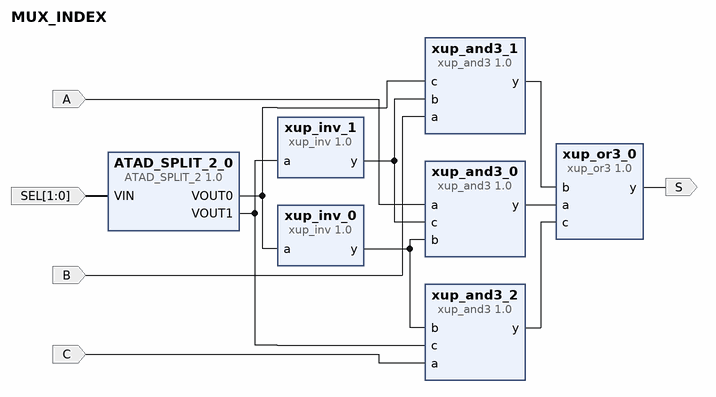
[diagram p0: block diagram of the top level]
# Vivado block design MUX_INDEX, xc7a100tcsg324-1, Vivado 2020.1
create_bd_design MUX_INDEX

create_bd_port -dir I A
create_bd_port -dir I B
create_bd_port -dir I C
create_bd_port -dir I -from 1 -to 0 SEL
create_bd_port -dir O S

create_bd_cell -type ip -vlnv xilinx.com:user:ATAD_SPLIT_2:1.0 ATAD_SPLIT_2_0
create_bd_cell -type ip -vlnv xilinx.com:xup:xup_inv:1.0 xup_inv_0
create_bd_cell -type ip -vlnv xilinx.com:xup:xup_inv:1.0 xup_inv_1
create_bd_cell -type ip -vlnv xilinx.com:xup:xup_and3:1.0 xup_and3_0
create_bd_cell -type ip -vlnv xilinx.com:xup:xup_and3:1.0 xup_and3_1
create_bd_cell -type ip -vlnv xilinx.com:xup:xup_and3:1.0 xup_and3_2
create_bd_cell -type ip -vlnv xilinx.com:xup:xup_or3:1.0 xup_or3_0

# ---- connections ----

connect_bd_net [get_bd_ports SEL] [get_bd_pins ATAD_SPLIT_2_0/VIN]
connect_bd_net [get_bd_pins ATAD_SPLIT_2_0/VOUT1] [get_bd_pins xup_inv_1/a] [get_bd_pins xup_and3_2/c]
connect_bd_net [get_bd_ports A] [get_bd_pins xup_and3_0/a]
connect_bd_net [get_bd_pins ATAD_SPLIT_2_0/VOUT0] [get_bd_pins xup_inv_0/a] [get_bd_pins xup_and3_1/c]
connect_bd_net [get_bd_pins xup_inv_0/y] [get_bd_pins xup_and3_0/b] [get_bd_pins xup_and3_2/b]
connect_bd_net [get_bd_pins xup_inv_1/y] [get_bd_pins xup_and3_0/c] [get_bd_pins xup_and3_1/b]
connect_bd_net [get_bd_ports B] [get_bd_pins xup_and3_1/a]
connect_bd_net [get_bd_ports C] [get_bd_pins xup_and3_2/a]
connect_bd_net [get_bd_pins xup_and3_0/y] [get_bd_pins xup_or3_0/a]
connect_bd_net [get_bd_pins xup_and3_1/y] [get_bd_pins xup_or3_0/b]
connect_bd_net [get_bd_pins xup_and3_2/y] [get_bd_pins xup_or3_0/c]
connect_bd_net [get_bd_pins xup_or3_0/y] [get_bd_ports S]

validate_bd_design
save_bd_design
